# EAGLE design untitled (EAGLE 6.5.0)
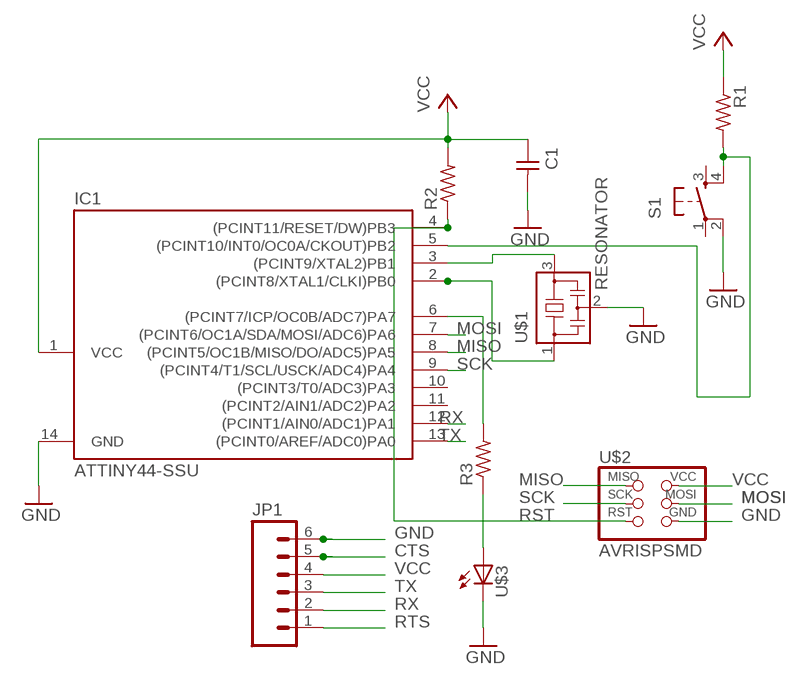
[diagram p0: schematic, sheet 1]

## Parts
C1  UNPOLARIZED_CAPACITOR1206  [1206]
IC1  ATTINY44-SSU  [SOIC14]
JP1  M06SMD  [1X06-SMD]
R1  RESISTOR1206  [1206]
R2  RESISTOR1206  [1206]
R3  RESISTOR1206  [1206]
S1  6MM_SWITCH6MM_SWITCH  [6MM_SWITCH]
U$1  RESONATOR  [EFOBM]
U$2  AVRISPSMD  [2X03SMD]
U$3  LED1206  [1206]

## Nets
CTS: JP1.5
GND: C1.2 IC1.14(GND) JP1.6 S1.2(P1) U$1.2 U$2.6(GND) U$3.2(C)
MISO: IC1.8((PCINT5/OC1B/MISO/DO/ADC5)PA5) U$2.1(MISO)
MOSI: IC1.7((PCINT6/OC1A/SDA/MOSI/ADC6)PA6) U$2.4(MOSI)
N$1: IC1.2((PCINT8/XTAL1/CLKI)PB0) U$1.1
N$2: IC1.3((PCINT9/XTAL2)PB1) U$1.3
N$4: R3.1 U$3.1(A)
N$5: IC1.6((PCINT7/ICP/OC0B/ADC7)PA7) R3.2
N$6: IC1.5((PCINT10/INT0/OC0A/CKOUT)PB2) R1.2 S1.4(S1)
RST: IC1.4((PCINT11/RESET/DW)PB3) R2.1 U$2.5(RST)
RTS: JP1.1
RX: IC1.12((PCINT1/AIN0/ADC1)PA1) JP1.2
SCK: IC1.9((PCINT4/T1/SCL/USCK/ADC4)PA4) U$2.3(SCK)
TX: IC1.13((PCINT0/AREF/ADC0)PA0) JP1.3
VCC: C1.1 IC1.1(VCC) JP1.4 R1.1 R2.2 U$2.2(VCC)
Unconnected: IC1.10((PCINT3/T0/ADC3)PA3) IC1.11((PCINT2/AIN1/ADC2)PA2) S1.1(P) S1.3(S)

## Library data of the parts
C1 = 01_FAB_Hello:UNPOLARIZED_CAPACITOR: unpolarized_capacitor
IC1 = 01_FAB_Hello:ATTINY44
JP1 = 01_SparkFun:M06: Header 6 Standard 6-pin 0.1" header. Use with straight break away headers (SKU : PRT-00116), right angle break away headers (PRT-00553), swiss pins (PRT-00743), machine pins (PRT-00117), and female headers (PRT-00115). Molex polarized connector foot print use with SKU : PRT-08094 with associated crimp pins and housings. NOTES ON THE VARIANTS LOCK and LOCK_LONGPADS... This footprint was designed to help hold the alignment of a through-hole component (i.e. 6-pin header) while soldering it into place. You may notice that each hole has been shifted either up or down by 0.005 of an inch from it's more standard position (which is a perfectly straight line). This slight alteration caused the pins (the squares in the middle) to touch the edges of the holes. Because they are alternating, it causes a "brace" to hold the component in place. 0.005 has proven to be the perfect amount of "off-center" position when using our standard breakaway headers. Although looks a little odd when you look at the bare footprint, once you have a header in there, the alteration is very hard to notice. Also, if you push a header all the way into place, it is covered up entirely on the bottom side. This idea of altering the position of holes to aid alignment will be further integrated into the Sparkfun Library for other footprints. It can help hold any component with 3 or more connection pins.
R1-R3 = 01_FAB_Hello:RESISTOR
S1 = 01_FAB_Hello:6MM_SWITCH: OMRON SWITCH
U$1 = 01_fab:RESONATOR
U$2 = 01_fab:AVRISP
U$3 = 01_FAB_Hello:LED

## Board
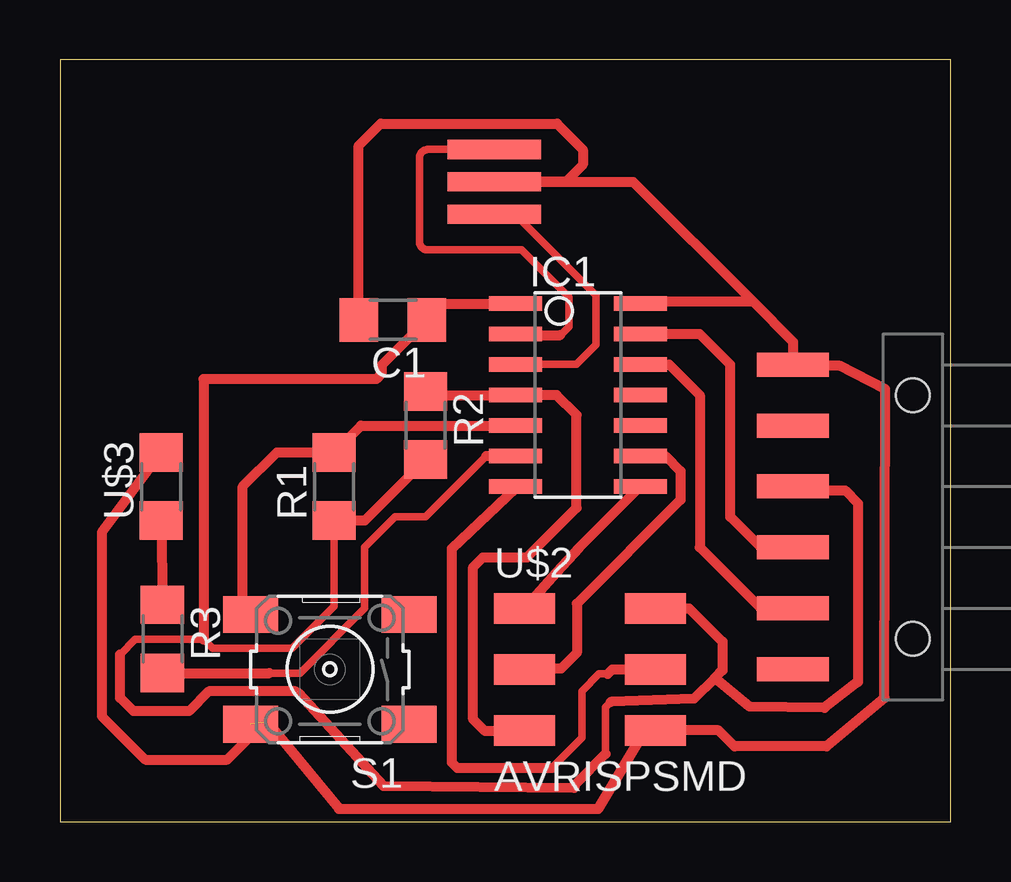
[diagram p1: board, top side]

Size 37.13 x 31.74 mm. Coordinates in mm from the lower left corner, seen from the top.
Outline: 0,0 37.13,0 37.13,31.74 0,31.74 0,0
Copper layers (1*16): Top 0.035mm / dielectric 1.5mm / Bottom 0.035mm
Design rules "default": minimum track width 10mil, minimum drill 24mil, track to track 8mil, track to pad 8mil, pad to pad 8mil, via to via 8mil, smd to smd 8mil, copper to edge 40mil, drill to drill 8mil, minimum pad ring 10mil, minimum via ring 8mil, stop-mask expansion 4mil, vias tented up to drill 0mil, thermal gap 10mil

### Footprints (pad centres in the part's own frame; a part is rotated, then mirrored left to right if it is on the bottom)
1206 = smd 1.6 x 1.803: 1 -1.422,0; 2 1.422,0
SOIC14 = smd 0.61 x 2.21: 1 -3.81,-2.603; 2 -2.54,-2.603; 3 -1.27,-2.603; 4 0,-2.603; 5 1.27,-2.603; 6 2.54,-2.603; 7 3.81,-2.603; 8 3.81,2.603; 9 2.54,2.603; 10 1.27,2.603; 11 0,2.603; 12 -1.27,2.603; 13 -2.54,2.603; 14 -3.81,2.603
1X06-SMD = smd 1 x 3: 1 -6.35,5; 2 -3.81,5; 3 -1.27,5; 4 1.27,5; 5 3.81,5; 6 6.35,5 | hole 1.4: -5.08,0; 5.08,0
6MM_SWITCH = smd 2.286 x 1.524: 1 -3.302,2.286; 2 3.302,2.286; 3 -3.302,-2.286; 4 3.302,-2.286
EFOBM = smd 0.8 x 3.9: 1 -1.35,0; 2 0,0; 3 1.35,0
2X03SMD = smd 2.54 x 1.27: 1 -2.54,2.54; 2 2.92,2.54; 3 -2.54,0; 4 2.92,0; 5 -2.54,-2.54; 6 2.92,-2.54

### Placement (x,y rotation side)
C1  13.88,20.91 180 top
IC1  21.59,17.78 270 top
JP1  35.56,12.7 90 top
R1  11.43,13.97 90 top
R2  15.24,16.51 270 top
R3  4.27,7.62 270 top
S1  11.25,6.35 180 top
U$1  18.1,26.66 270 top
U$2  21.9,6.35 0 top
U$3  4.22,13.97 90 top

### Tracks (layer width: path | path; a pad name or v marks a point on that pad's centre or on a via)
GND  (1 unrouted)
  Top 0.406: U$3.2 1.74,12.06 1.74,4.4 3.56,2.59 6.98,2.59 8.53,4.14 8.66,4.14 11.63,0.54 22.45,0.54 24.41,3.81 U$2.6 27.45,3.81 28.12,3.15 31.96,3.15 31.99,3.18 34.37,5.17 34.4,18.02 32.51,18.99 30.62,18.99 JP1.6 30.56,20 28.88,21.68 | IC1.14 24.29,21.68 28.88,21.68 | C1.2 12.45,28.17 13.37,29.09 20.72,29.09 21.8,28.01 21.8,27.38 21.08,26.66 U$1.2 23.89,26.66 28.88,21.68
MISO
  Top 0.406: U$2.1 20.7,10.4 21.65,11.43 IC1.8
MOSI
  Top 0.305: 20.5,2.25 21.76,3.5 21.76,5.44 22.48,6.16 22.83,6.16
  Top 0.406: IC1.7 18.99,13.91 16.33,11.38 16.33,6.3 16.33,2.47 16.55,2.25 20.5,2.25 | 22.83,6.16 23.02,6.35 U$2.4
N$1
  Top 0.305: IC1.2 19.03,20.27 | U$1.1 15.35,28.01 arc90 14.98,27.65 14.98,24.18 arc90 15.34,23.82 19.24,23.82 21.22,21.85 21.22,20.64 20.86,20.28
  Top 0.406: IC1.2 19.03,20.28 20.86,20.28
N$2
  Top 0.305: U$1.3 18.96,25.31 22.34,21.94 22.34,19.87 21.53,19.06 IC1.3 19.05,18.99
  Top 0.406: IC1.3 18.97,19.07
N$4
  Top 0.406: U$3.1 R3.1
N$5
  Top 0.305: 8.74,6.2 10.01,6.2 12.7,8.89 12.7,11.43 13.97,12.7 15.24,12.7 17.78,15.24
  Top 0.406: R3.2 8.74,6.2 | 17.78,15.24 IC1.6
N$6
  Top 0.406: S1.4 7.62,9.14 7.62,13.97 9.04,15.39 R1.2 12.55,16.51 IC1.5
RST
  Top 0.406: R2.1 15.39,17.78 IC1.4 20.71,17.78 21.53,16.95 21.53,13.08 19.47,11.02 17.63,11.02 17.23,10.61 17.23,4.27 17.72,3.78 19.33,3.78 U$2.5
RX
  Top 0.406: IC1.12 25.4,19.05 26.67,17.78 26.67,11.43 29.21,8.89 JP1.2
SCK
  Top 0.406: IC1.9 25.23,15.24 25.86,14.61 25.86,13.41 21.55,9.09 21.55,7.04 20.89,6.38 19.08,6.38 U$2.3
TX
  Top 0.406: JP1.3 29.21,11.43 27.94,12.7 27.94,19.05 26.67,20.32 IC1.13
VCC
  Top 0.305: 2.5,6.96 3.14,7.6 5.98,7.6 6.36,7.23 9.68,7.23 11.43,8.97 R1.1 | 22.97,5 22.74,4.77 22.74,2.83
  Top 0.406: R2.2 12.7,12.55 R1.1 | U$2.2 26.23,8.89 27.62,7.5 27.62,6.31 27.29,5.99 | 27.29,5.99 26.43,5.13 22.97,5 | 2.5,6.96 2.5,5.17 3.06,4.61 5.38,4.61 6.21,5.43 9.83,5.43 9.91,5.36 9.94,5.36 13.49,1.49 21.44,1.4 21.44,1.53 22.74,2.83 | JP1.4 arc90 30.72,13.81 32.73,13.81 33.27,13.27 33.27,5.83 31.87,4.75 28.75,4.8 27.29,5.99 | 5.98,7.6 5.98,18.45 13.19,18.45 13.4,18.66 13.4,19.02 C1.1 15.98,21.59 IC1.1